# Altium schematic sheet DYBoard_Feeder.SchDoc
size A4; SheetNumber: 1; SheetTotal: 1
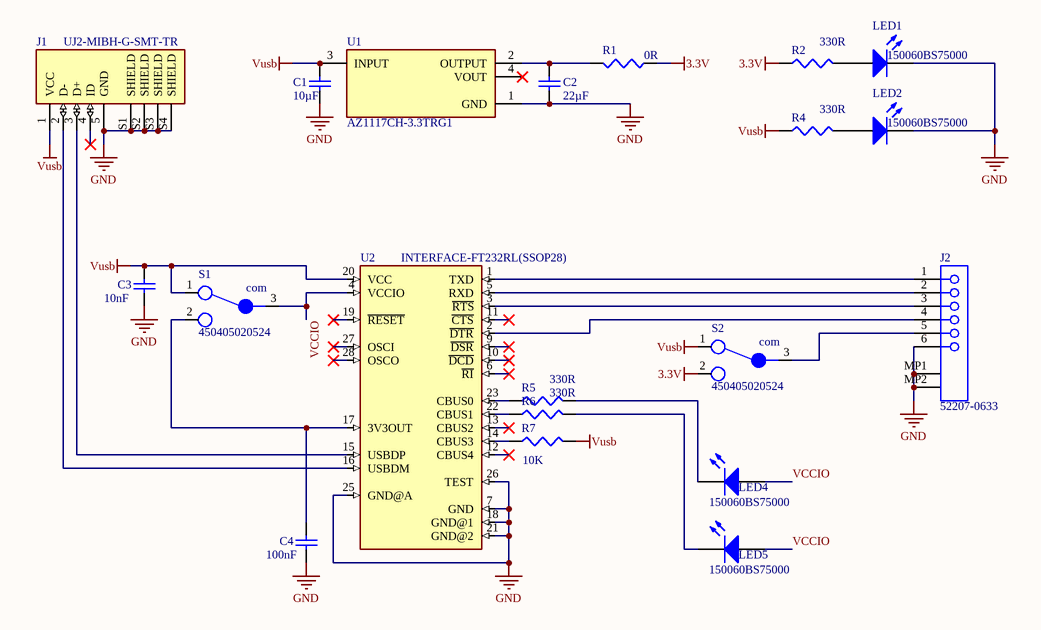
[diagram p0: DYBoard_Feeder.SchDoc]

## Parts
C1  value 10µF  [1608[0603]]  (hidden comment: Cap Semi)
C2  value 22µF  [1608[0603]]  (hidden comment: Cap Semi)
C3  value 10nF  [1608[0603]]  (hidden comment: Cap Semi)
C4  value 100nF  [1608[0603]]  (hidden comment: Cap Semi)
J1  UJ2-MIBH-G-SMT-TR  [CUI_UJ2-MIBH-G-SMT-TR]
J2  52207-0633  [MOLX-52207-0633]
LED1  150060BS75000  [0603_A]
LED2  150060BS75000  [0603_A]
LED4  150060BS75000  [0603_A]
LED5  150060BS75000  [0603_A]
R1  value 0R  [J1-0603]  (hidden comment: Res3)
R2  value 330R  [J1-0603]  (hidden comment: Res3)
R4  value 330R  [J1-0603]  (hidden comment: Res3)
R5  value 330R  [J1-0603]  (hidden comment: Res3)
R6  value 330R  [J1-0603]  (hidden comment: Res3)
R7  value 10K  [J1-0603]  (hidden comment: Res3)
S1  450405020524  [450405020524]
S2  450405020524  [450405020524]
U1  AZ1117CH-3.3TRG1  [FP-SOT223-MFG]
U2  INTERFACE-FT232RL(SSOP28)  [SSOP28-0.65-10.2X5.2MM]

## Nets
3.3V: R1.1 R2.1 S2.2
GND: C1.1 C2.1 C3.1 C4.1 J1.5(GND) J1.S1(SHIELD) J1.S2(SHIELD) J1.S3(SHIELD) J1.S4(SHIELD) J2.6 J2.MP1 J2.MP2 LED1.1(K) LED2.1(K) U1.1(GND) U2.7(GND) U2.18(GND@1) U2.21(GND@2) U2.25(GND@A) U2.26(TEST)
Vusb: C1.2 C3.2 J1.1(VCC) R4.1 R7.2 S1.1 S2.1 U1.3(INPUT) U2.20(VCC)
VCCIO: LED4.2(A) LED5.2(A) S1.3 U2.4(VCCIO)
NetC2_2: C2.2 R1.2 U1.2(OUTPUT)
NetC4_2: C4.2 S1.2 U2.17(3V3OUT)
NetJ1_2: J1.2(D-) U2.16(USBDM)
NetJ1_3: J1.3(D+) U2.15(USBDP)
NetJ2_1: J2.1 U2.1(TXD)
NetJ2_2: J2.2 U2.5(RXD)
NetJ2_3: J2.3 U2.3(~{RTS})
NetJ2_4: J2.4 U2.2(~{DTR})
NetJ2_5: J2.5 S2.3
NetLED1_2: LED1.2(A) R2.2
NetLED2_2: LED2.2(A) R4.2
NetLED4_1: LED4.1(K) R5.2
NetLED5_1: LED5.1(K) R6.2
NetR5_1: R5.1 U2.23(CBUS0)
NetR6_1: R6.1 U2.22(CBUS1)
NetR7_1: R7.1 U2.14(CBUS3)

Not connected (* = marked no-connect by the designer): J1 4(ID)*; U1 4(VOUT)*; U2 6(~{RI})* 9(~{DSR})* 10(~{DCD})* 11(~{CTS})* 12(CBUS4)* 13(CBUS2)* 19(~{RESET})* 27(OSCI)* 28(OSCO)*

## Notes on the sheet
- (in symbol 450405020524) com

## Library data of the parts
C1-C4 = Cap Semi: Capacitor (Semiconductor SIM Model); Published: 8-Jun-2000; LatestRevisionDate: 29-May-2009; LatestRevisionNote: IPC-7351 Footprint Added.; PackageReference: C1206; Publisher: Altium Limited; PackageDescription: Chip Capacitor
J1 = UJ2-MIBH-G-SMT-TR: Micro B, USB 2.0, 1.8 A, Right Angle, Surface Mount (SMT), USB Receptacle; MF: CUI Devices; Check_prices: https://www.snapeda.com/parts/UJ2-MIBH-G-SMT-TR/CUI%20Devices/view-part/5487872/?ref=eda; Availability: Warning; CUI_purchase_URL: https://www.cuidevices.com/product/interconnect/connectors/usb-connectors/uj2-mibh-g-smt-tr?utm_source=snapeda.com&utm_medium=referral&utm_campaign=snapedaBOM; Price: None; Package: None; Value: *; Purchase-URL: https://pricing.snapeda.com/search/part/UJ2-MIBH-G-SMT-TR/?ref=eda; SnapEDA_Link: https://www.snapeda.com/parts/UJ2-MIBH-G-SMT-TR/CUI%20Devices/view-part/5487872/?ref=snap; MP: UJ2-MIBH-G-SMT-TR
J2 = CMP-1241-00174-1: 1.0 mm Pitch Easy-On(TM) Type FPC Connector, 2.7 mm Mated Height, Right Angle, ZIF, SMT, Top Contact, 6 Circuits, -40 to 85 degC, ELV and RoHS Compliant, Tape and Reel; Manufacturer: Molex; PCB Locator: No; Material - Plating Mating: Silver, Tin-Bismuth; Pitch - Termination Interface: 1.00mm; Voltage (Max): 125V; Current (Max per Contact): 1A; Mated Height: 2.70mm; Durability (mating cycles max): 30; PCB Retention: Yes; Material - Metal: Phosphor Bronze; Circuits (Loaded): 6; Entry Angle: 90degrees Angle; Stackable: No; ComponentLink1URL: http://www.molex.com/molex/index.jsp; Packing: Tape and Reel; PackageReference: 52207-0633; Mounting Technology: Surface Mount; Pitch - Mating Interface: 1.00mm; ComponentLink3URL: http://www.molex.com/pdm_docs/sd/522070633_sd.pdf; ComponentLink1Description: Manufacturer URL; RoHS: TRUE; Contact Position: Top; ComponentLink2URL: http://www.molex.com/webdocs/datasheets/pdf/en-us/0522070633_FFC_FPC_CONNECTORS.pdf; ComponentLink3Description: Package Specification; PackageDescription: 6-Lead FPC Connector, Pitch 1.0 mm; PackageVersion: Rev. B, 08/2013; PartNumber: 52207-0633; Number of Rows: 1; Polarized to PCB: Yes; Orientation: Right Angle; ComponentLink2Description: Datasheet; Material - Plating Termination: Silver, Tin-Bismuth
LED1 LED2 LED4 LED5 = CMP-1426-00003-1: SMD mono-color Chip LED, WL-SMCW, Blue; Manufacturer: Wuerth Elektronik; Color: Blue; ComponentLink2Description: Datasheet; ComponentLink2URL: http://katalog.we-online.com/led/datasheet/150060BS75000.pdf; ComponentLink1URL: http://www.we-online.com; PackageReference: 0603_A; PartNumber: 150060BS75000; ComponentLink1Description: Manufacturer URL
R1 R2 R4-R7 = Res3: Resistor; Published: 8-Jun-2000; LatestRevisionDate: 29-May-2009; LatestRevisionNote: IPC-7351 Footprint Added.; PackageReference: J1-0603; Publisher: Altium Limited; PackageDescription: Chip Resistor
S1 S2 = 450405020524: SMT 8.7 X 3.0 MM MINI SLIDE SWIT; MF: WÃ¼rth Elektronik; Availability: Warning; Value: *; Check_prices: https://www.snapeda.com/parts/450405020524/Wurth%20Electronics%20Inc./view-part/4900805/?ref=eda; Package: None; SnapEDA_Link: https://www.snapeda.com/parts/450405020524/Wurth%20Electronics%20Inc./view-part/4900805/?ref=snap; Price: None; MP: 450405020524; Purchase-URL: https://pricing.snapeda.com/search/part/450405020524/?ref=eda
U1 = CMP-12756-000028-1: IC REG LINEAR 3.3V 800MA SOT223; Accuracy: 1%; Reference Voltage: 1.262V; Quiescent Current: 6mA; Power Supply Rejection Ratio (PSRR): 70dB; Max Input Voltage: 15V; Max Output Current: 1.35A; Output Type: Fixed; Min Current Limit: 1A; Number of Regulators: 1; Polarity: Positive; Dropout Voltage: 1.2V; Output Current: 800mA; Width: 3.7mm; Case/Package: SOT-223; Length: 6.7mm; Mount: Surface Mount; Output Voltage: 3.3V; Lead Free: Lead Free; Min Operating Temperature: -20°C; Packaging: Tape and Reel; Package Quantity: 4000; Max Operating Temperature: 125°C; Number of Pins: 4; Number of Outputs: 1; Height: 1.7mm
U2 = INTERFACE-FT232RL(SSOP28): USB Bridge, USB to UART USB 2.0 UART Interface 28-SSOP; MF: FTDI, Future; SnapEDA_Link: https://www.snapeda.com/parts/FT232RL/FTDI,%20Future%20Technology%20Devices%20International%20Ltd/view-part/45080/?ref=snap; Availability: Unavailable; Package: SSOP-28 FTDI; Price: None; MP: FT232RL; Check_prices: https://www.snapeda.com/parts/FT232RL/FTDI,%20Future%20Technology%20Devices%20International%20Ltd/view-part/45080/?ref=eda; Value: *